# EAGLE schematic Odometer (EAGLE 6.4)
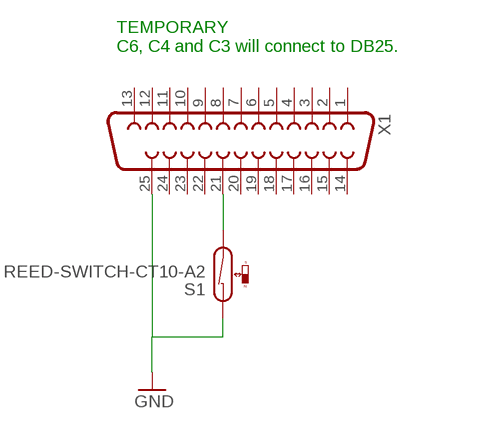
[diagram p0: schematic, sheet 1]

## Parts
S1  REED-SWITCH-CT10-A2  [CT10-A2]
X1  F25H  [F25H]

## Nets
GND: S1.1 X1.25
N$1: S1.2 X1.21
Unconnected: X1.1 X1.2 X1.3 X1.4 X1.5 X1.6 X1.7 X1.8 X1.9 X1.10 X1.11 X1.12 X1.13 X1.14 X1.15 X1.16 X1.17 X1.18 X1.19 X1.20 X1.22 X1.23 X1.24

## Notes on the sheet
- TEMPORARY
  C6, C4 and C3 will connect to DB25.

## Library data of the parts
S1 = switch-reed:REED-SWITCH-: Reed Sensor; OC_FARNELL: unknown
X1 = con-subd:F25: SUB-D; OC_FARNELL: unknown; OC_NEWARK: unknown